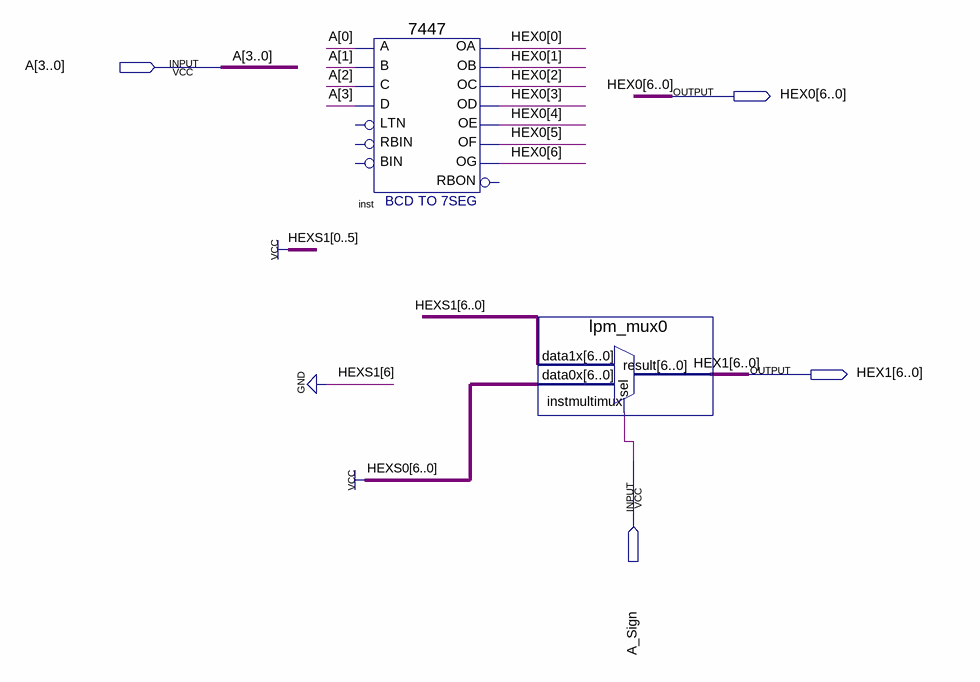
[diagram p0: schematic sheet]
// Quartus schematic NumberDisplay.bdf as structural Verilog: 2 symbols, 4 pins
module NumberDisplay (
  input  [3:0] A,
  input  A_Sign,
  output [6:0] HEX0,
  output [6:0] HEX1
);

  \7447  inst (
    .B(A[1]), .C(A[2]), .D(A[3]), .A(A[0]), .OB(HEX0[1]), .OC(HEX0[2]), .OE(HEX0[4]), .OD(HEX0[3]),
    .OF(HEX0[5]), .OG(HEX0[6]), .OA(HEX0[0]));  // open: LTN, RBIN, BIN, RBON
  lpm_mux0 instmultimux (.data1x(7'b0111111), .data0x({7{1'b1}}), .sel(A_Sign), .result(HEX1));
endmodule
